# EAGLE design PeepShow (EAGLE 8.1.1)
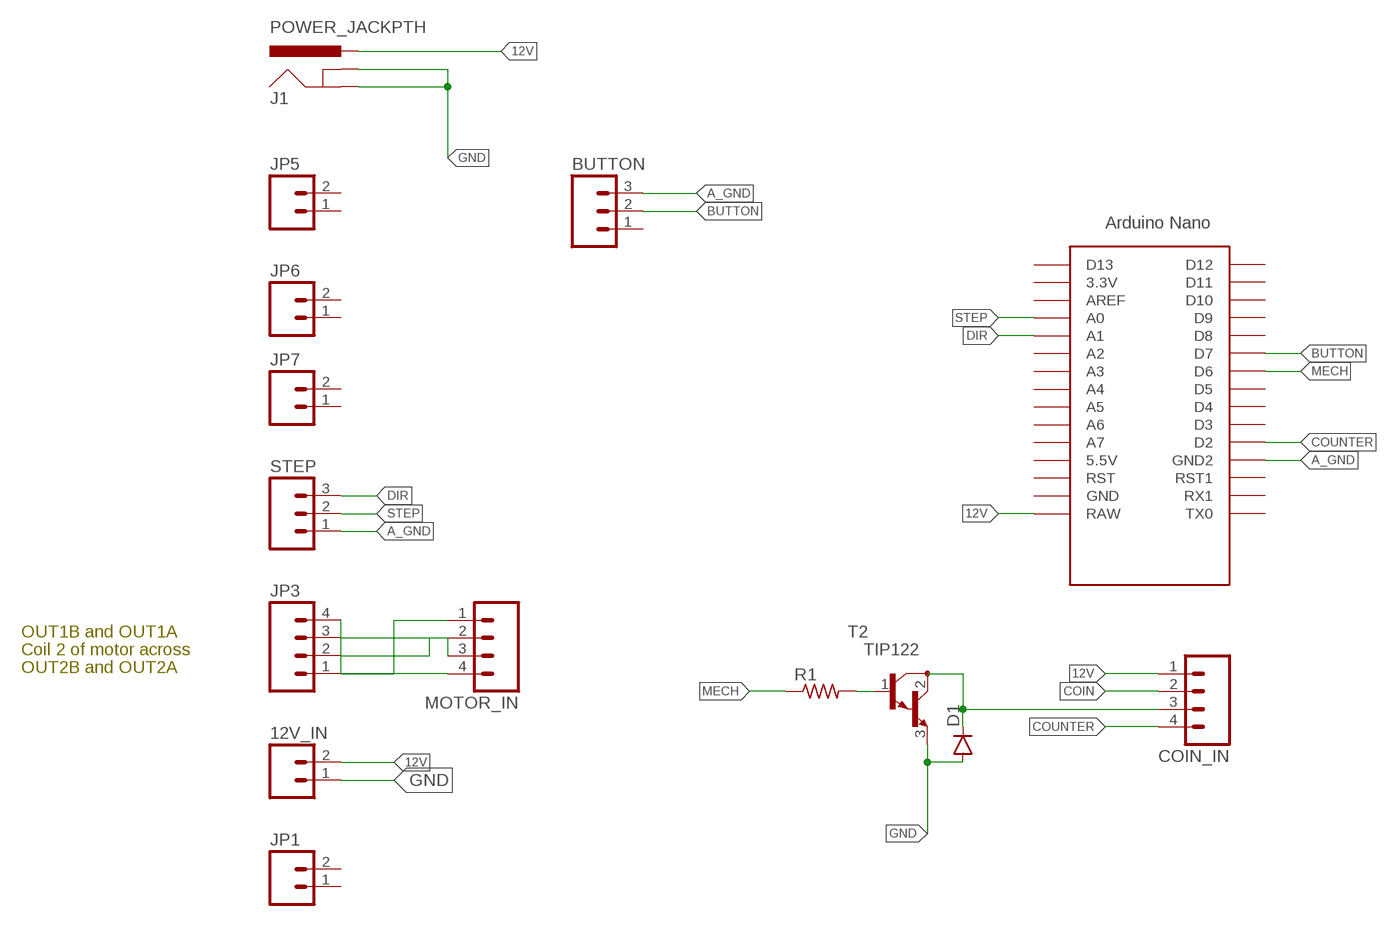
[diagram p0: schematic, sheet 1]

## Parts
12V_IN  M021X02_NO_SILK  [1X02_NO_SILK]
BUTTON  M031X03_NO_SILK  [1X03_NO_SILK]
COIN_IN  M041X04_NO_SILK  [1X04_NO_SILK]
D1  DIODEPTH  [DIODE-1N4001]
J1  POWER_JACKPTH  [POWER_JACK_PTH]
JP1  M021X02_NO_SILK  [1X02_NO_SILK]
JP3  M041X04_NO_SILK  [1X04_NO_SILK]
JP5  M021X02_NO_SILK  [1X02_NO_SILK]
JP6  M021X02_NO_SILK  [1X02_NO_SILK]
JP7  M021X02_NO_SILK  [1X02_NO_SILK]
MOTOR_IN  M041X04_NO_SILK  [1X04_NO_SILK]
R1  R-US_0411/3V  [0411V]
STEP  M031X03_NO_SILK  [1X03_NO_SILK]
T2  TIP122  [TO220]
U$1  NANO  [NANO]

## Nets
12V: 12V_IN.2 COIN_IN.1 J1.PWR U$1.RAW
A_GND: BUTTON.3 STEP.1 U$1.GND1(GND2)
BUTTON: BUTTON.2 U$1.D7
COIN: COIN_IN.2
COUNTER: COIN_IN.4 U$1.D2
DIR: STEP.3 U$1.A1
GND: 12V_IN.1 D1.A J1.GND J1.GNDBREAK T2.3(E)
MECH: R1.1 U$1.D6
N$1: COIN_IN.3 D1.C T2.2(C)
N$2: R1.2 T2.1(B)
N$3: JP3.1 MOTOR_IN.1
N$4: JP3.2 MOTOR_IN.2
N$5: JP3.3 MOTOR_IN.3
N$6: JP3.4 MOTOR_IN.4
STEP: STEP.2 U$1.A0
Unconnected: BUTTON.1 JP1.1 JP1.2 JP5.1 JP5.2 JP6.1 JP6.2 JP7.1 JP7.2 U$1.3.3V U$1.5V(5.5V) U$1.A2 U$1.A3 U$1.A4 U$1.A5 U$1.A6 U$1.A7 U$1.AREF U$1.D3 U$1.D4 U$1.D5 U$1.D8 U$1.D9 U$1.D10 U$1.D11 U$1.D12 U$1.D13 U$1.GND U$1.ICSP1 U$1.ICSP2 U$1.ICSP3 U$1.ICSP4 U$1.ICSP5 U$1.ICSP6 U$1.RST U$1.RST1 U$1.RX1 U$1.TX0

## Notes on the sheet
- OUT1B and OUT1A
- Coil 2 of motor across
- OUT2B and OUT2A

## Library data of the parts
12V_IN JP1 JP5-JP7 = SparkFun:M02: Header 2 Standard 2-pin 0.1" header. Use with straight break away headers (SKU : PRT-00116), right angle break away headers (PRT-00553), swiss pins (PRT-00743), machine pins (PRT-00117), and female headers (PRT-00115). Molex polarized connector foot print use with SKU : PRT-08233 with associated crimp pins and housings.
BUTTON STEP = SparkFun:M03: Header 3 Standard 3-pin 0.1" header. Use with straight break away headers (SKU : PRT-00116), right angle break away headers (PRT-00553), swiss pins (PRT-00743), machine pins (PRT-00117), and female headers (PRT-00115). Molex polarized connector foot print use with SKU : PRT-08232 with associated crimp pins and housings.
COIN_IN JP3 MOTOR_IN = SparkFun:M04: Header 4 Standard 4-pin 0.1" header. Use with straight break away headers (SKU : PRT-00116), right angle break away headers (PRT-00553), swiss pins (PRT-00743), machine pins (PRT-00117), and female headers (PRT-00115). Molex polarized connector foot print use with SKU : PRT-08231 with associated crimp pins and housings.
D1 = SparkFun-DiscreteSemi:DIODE: Diode These are standard reverse protection diodes and small signal diodes. SMA package can handle up to about 1A. SOD-323 can handle about 200mA. What the SOD-323 package when ordering, there are some mfgs out there that are 5-pin packages.
J1 = SparkFun-Connectors:POWER_JACK: Power Jack This is the standard 5.5mm barrel jack for power. The PTH is the most common, proven, reliable, footprint. The Slot footprint only works if the mill layer is transmitted to the PCB fab house so be warned. Mating wall wart : TOL-00298 (and others); PROD_ID: CONN-08197
R1 = adafruit:R-US_: RESISTOR, American symbol
T2 = transistor:TIP122: NPN BIPOLAR DARLINGTON TRANSISTOR
U$1 = Arduino-clone:NANO: Arduino Nano

## Board
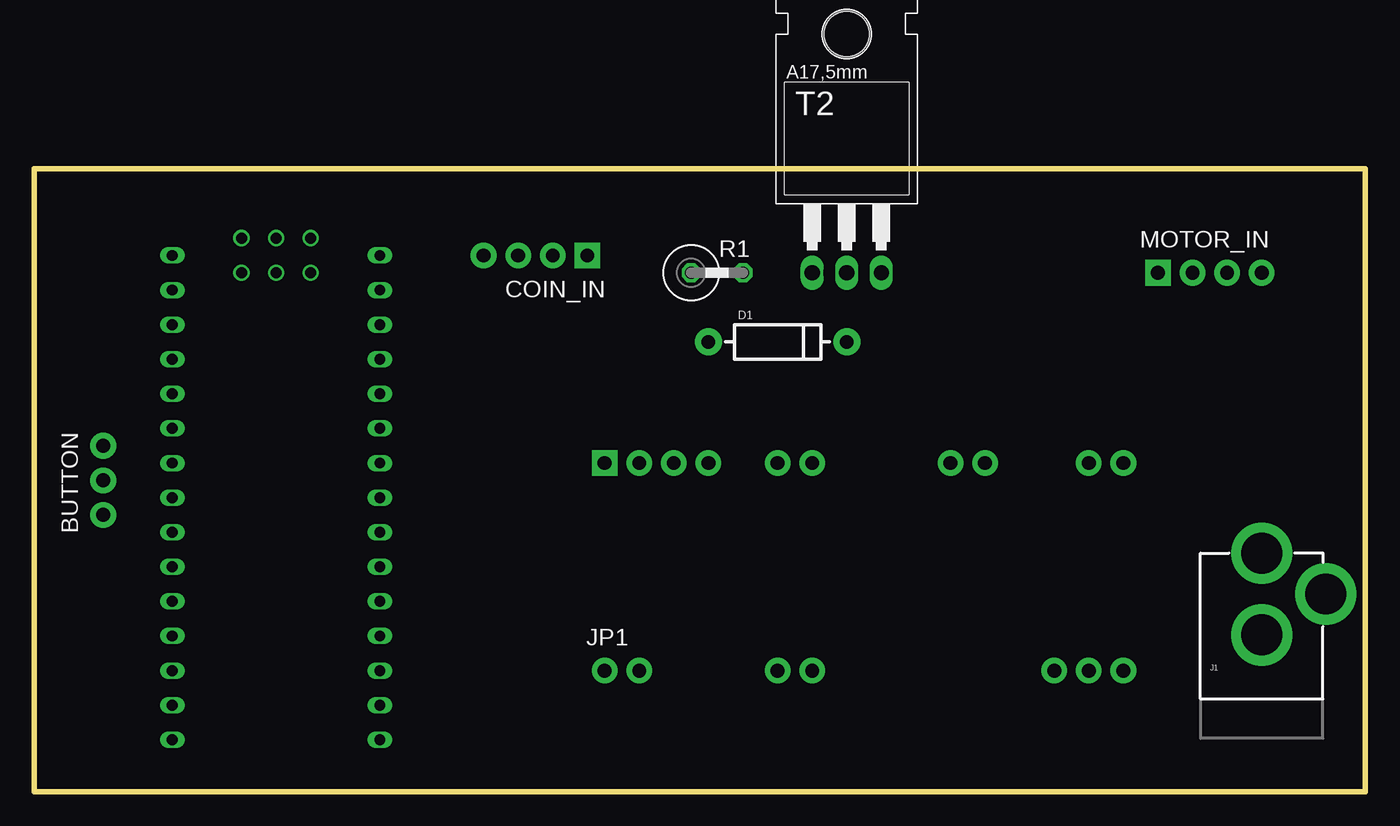
[diagram p1: board, top side]
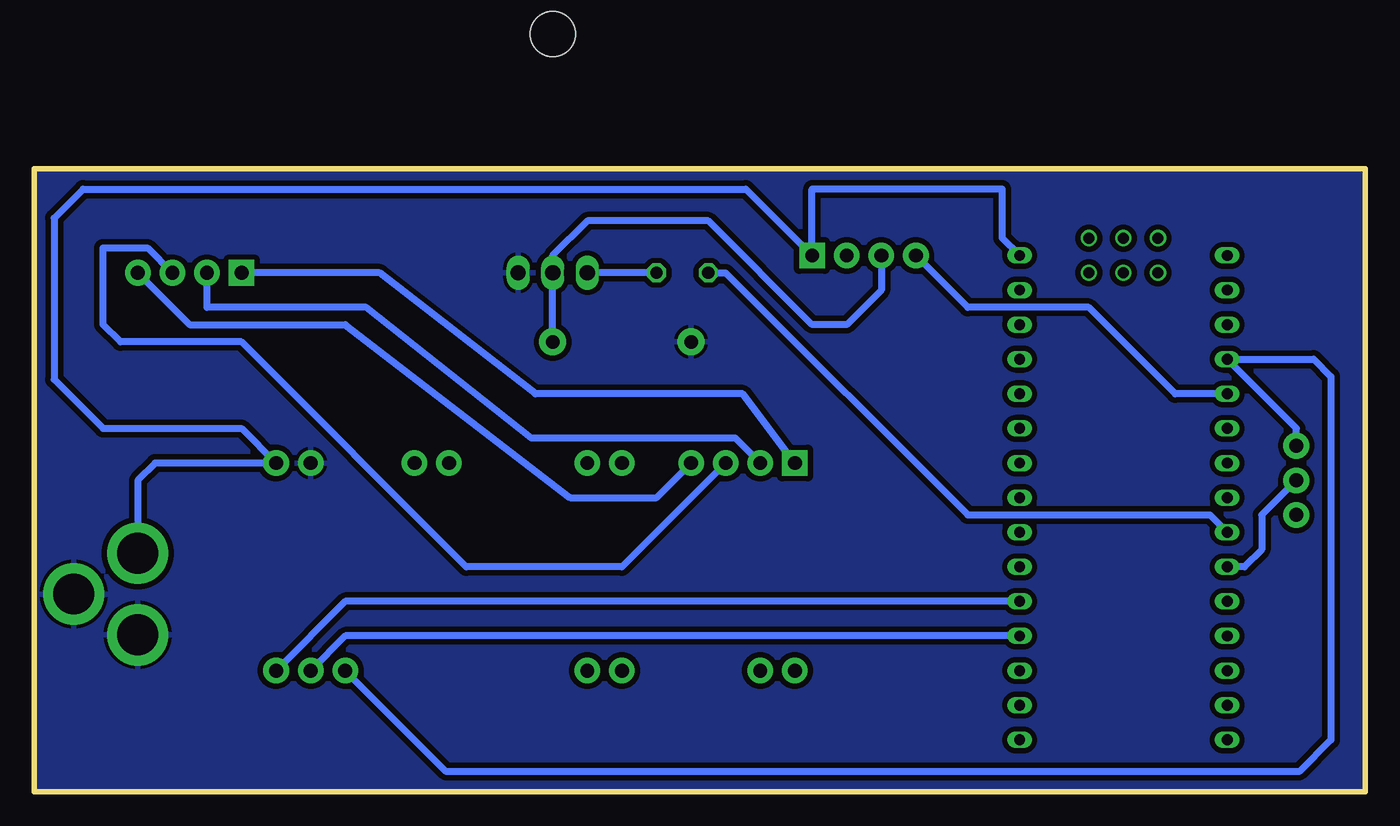
[diagram p2: board, bottom side, seen from below]

Size 97.79 x 45.72 mm. Coordinates in mm from the lower left corner, seen from the top.
Outline: 0,0 97.79,0 97.79,45.72 0,45.72 0,0
Copper layers (1*16): Top 0.035mm / dielectric 1.5mm / Bottom 0.035mm
Design rules "OthermillDRC_1_64_v2": minimum track width 16mil, minimum drill 31mil, track to track 0.39878125mm, track to pad 0.39878125mm, pad to pad 0.39878125mm, via to via 0.39878125mm, smd to smd 0mil, copper to edge 0mil, drill to drill 1mil, minimum pad ring 0mil, minimum via ring 15mil, stop-mask expansion 1mil, vias tented up to drill 30mil, thermal gap 10mil

### Footprints (pad centres in the part's own frame; a part is rotated, then mirrored left to right if it is on the bottom)
1X02_NO_SILK = drill 1.016 pad 1.88: 1 0,0; 2 2.54,0
1X03_NO_SILK = drill 1.016 pad 1.88: 1 0,0; 2 2.54,0; 3 5.08,0
1X04_NO_SILK = drill 1.016 pad 1.88 square: 1 0,0 | drill 1.016 pad 1.88: 2 2.54,0; 3 5.08,0; 4 7.62,0
DIODE-1N4001 = drill 1 pad 1.981: A -5.08,0; C 5.08,0
POWER_JACK_PTH = drill 2.997 pad 4.318: GND 0,7.7; GNDBREAK 4.7,10.7; PWR 0,13.7
0411V = drill 0.914 octagon: 1 -2.54,0; 2 1.27,0
TO220 = drill 1.118 long: 1 -2.54,-6.35; 2 0,-6.35; 3 2.54,-6.35 | hole 3.302: 0,11.176
NANO = drill 0.8 long: 3.3V -10.16,24.13; 5V -10.16,-1.27; A0 -10.16,19.05; A1 -10.16,16.51; A2 -10.16,13.97; A3 -10.16,11.43; A4 -10.16,8.89; A5 -10.16,6.35; A6 -10.16,3.81; A7 -10.16,1.27; AREF -10.16,21.59; D2 5.08,1.27; D3 5.08,3.81; D4 5.08,6.35; D5 5.08,8.89; D6 5.08,11.43; D7 5.08,13.97; D8 5.08,16.51; D9 5.08,19.05; D10 5.08,21.59; D11 5.08,24.13; D12 5.08,26.67; D13 -10.16,26.67; GND -10.16,-6.35; GND1 5.08,-1.27; RAW -10.16,-8.89; RST -10.16,-3.81; RST1 5.08,-3.81; RX1 5.08,-6.35; TX0 5.08,-8.89 | drill 0.8: ICSP1 -5.08,-10.16; ICSP2 -5.08,-7.62; ICSP3 -2.54,-10.16; ICSP4 -2.54,-7.62; ICSP5 0,-10.16; ICSP6 0,-7.62

### Placement (x,y rotation side)
12V_IN  77.47,24.13 0 top
BUTTON  5.08,20.32 90 top
COIN_IN  40.64,39.37 180 top
D1  54.61,33.02 0 top
J1  90.17,3.81 0 top
JP1  41.91,8.89 0 top
JP3  41.91,24.13 0 top
JP5  57.15,8.89 180 top
JP6  67.31,24.13 0 top
JP7  54.61,24.13 0 top
MOTOR_IN  82.55,38.1 0 top
R1  50.8,38.1 0 top
STEP  74.93,8.89 0 top
T2  59.69,44.45 0 top
U$1  15.24,30.48 180 top

### Tracks (layer width: path | path; a pad name or v marks a point on that pad's centre or on a via)
12V
  Bottom 0.508: J1.PWR 90.17,22.86 88.9,24.13 12V_IN.2 82.55,26.67 92.71,26.67 96.32,30.28 96.32,42.11 94.18,44.25 45.52,44.25 COIN_IN.1 40.64,44.25 26.67,44.25 26.67,40.64 U$1.RAW
A_GND
  Bottom 0.508: BUTTON.3 5.08,26.67 U$1.GND1 3.81,31.75 2.54,30.48 2.54,3.81 4.88,1.47 67.51,1.47 STEP.1
BUTTON
  Bottom 0.508: BUTTON.2 7.62,20.32 7.62,17.78 8.89,16.51 U$1.D7
COUNTER
  Bottom 0.508: U$1.D2 13.97,29.21 20.32,35.56 29.21,35.56 COIN_IN.4
DIR
  Bottom 0.508: U$1.A1 74.93,13.97 STEP.3
GND
  pour Bottom: 0,0 97.79,0 97.79,45.72 0,45.72
MECH
  Bottom 0.508: R1.1 46.99,38.1 29.21,20.32 11.43,20.32 U$1.D6
N$1
  Bottom 0.508: COIN_IN.3 35.56,36.83 38.1,34.29 40.64,34.29 48.26,41.91 57.15,41.91 59.69,39.37 T2.2 D1.C
N$2
  Bottom 0.508: R1.2 T2.1
N$3
  Bottom 0.508: JP3.1 45.72,29.21 60.96,29.21 72.39,38.1 MOTOR_IN.1
N$4
  Bottom 0.508: JP3.2 46.28,25.96 61.25,25.96 73.4,35.56 85.09,35.56 MOTOR_IN.2
N$5
  Bottom 0.508: JP3.3 54.61,16.51 66.04,16.51 82.55,33.02 91.44,33.02 92.71,34.29 92.71,39.93 89.46,39.93 MOTOR_IN.3
N$6
  Bottom 0.508: MOTOR_IN.4 86.36,34.29 74.93,34.29 58.42,21.59 52.07,21.59 JP3.4
STEP
  Bottom 0.508: U$1.A0 74.93,11.43 STEP.2